# Altium schematic sheet 十六继电器.SchDoc: 阿波罗十六继电器控制器
size A4; Revision: V1.1; SheetNumber: 0; SheetTotal: 0
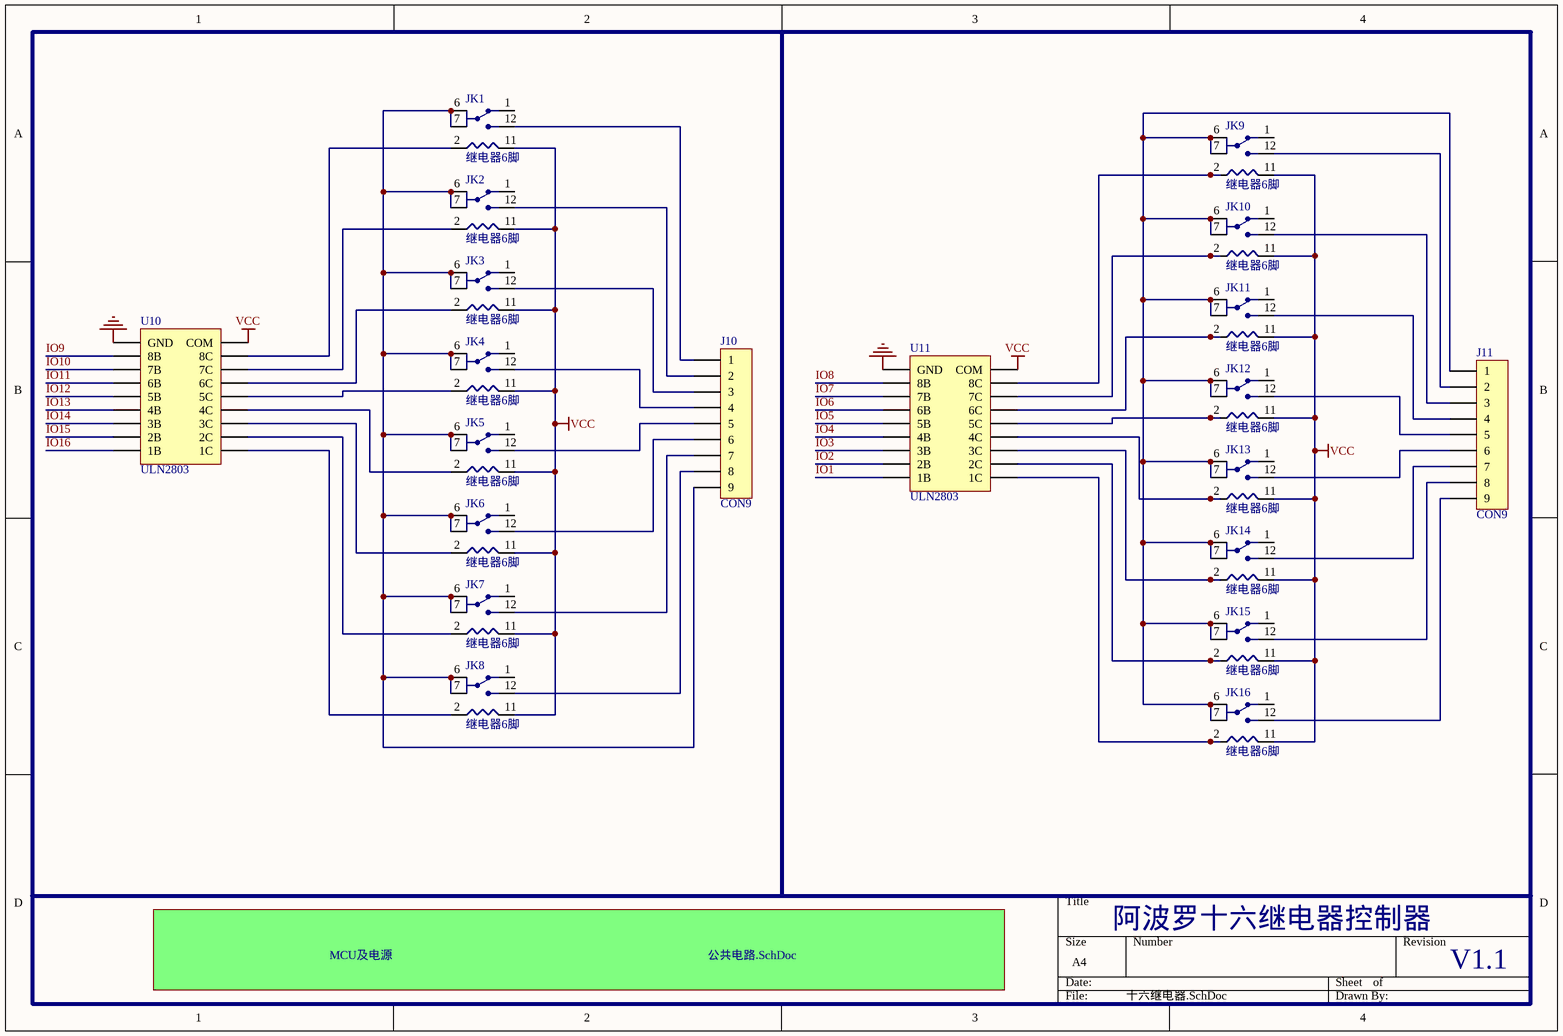
[diagram p0: 十六继电器.SchDoc]

## Parts
J10  CON9  [CON9*5.1]
J11  CON9  [CON9*5.1]
JK1  继电器6脚  [RL]
JK2  继电器6脚  [RL]
JK3  继电器6脚  [RL]
JK4  继电器6脚  [RL]
JK5  继电器6脚  [RL]
JK6  继电器6脚  [RL]
JK7  继电器6脚  [RL]
JK8  继电器6脚  [RL]
JK9  继电器6脚  [RL]
JK10  继电器6脚  [RL]
JK11  继电器6脚  [RL]
JK12  继电器6脚  [RL]
JK13  继电器6脚  [RL]
JK14  继电器6脚  [RL]
JK15  继电器6脚  [RL]
JK16  继电器6脚  [RL]
U10  ULN2803  [sol18]
U11  ULN2803  [sol18]

## Sub-sheets
MCU及电源 = 公共电路.SchDoc: no entries

## Nets
GND: U10.9(GND) U11.9(GND)
VCC: JK1.11 JK2.11 JK3.11 JK4.11 JK5.11 JK6.11 JK7.11 JK8.11 JK9.11 JK10.11 JK11.11 JK12.11 JK13.11 JK14.11 JK15.11 JK16.11 U10.10(COM) U11.10(COM)
IO1: U11.1(1B)
IO2: U11.2(2B)
IO3: U11.3(3B)
IO4: U11.4(4B)
IO5: U11.5(5B)
IO6: U11.6(6B)
IO7: U11.7(7B)
IO8: U11.8(8B)
IO9: U10.8(8B)
IO10: U10.7(7B)
IO11: U10.6(6B)
IO12: U10.5(5B)
IO13: U10.4(4B)
IO14: U10.3(3B)
IO15: U10.2(2B)
IO16: U10.1(1B)
NetJ10_1: J10.1 JK1.12
NetJ10_2: J10.2 JK2.12
NetJ10_3: J10.3 JK3.12
NetJ10_4: J10.4 JK4.12
NetJ10_5: J10.5 JK5.12
NetJ10_6: J10.6 JK6.12
NetJ10_7: J10.7 JK7.12
NetJ10_8: J10.8 JK8.12
NetJ10_9: J10.9 JK1.6 JK1.7 JK2.6 JK2.7 JK3.6 JK3.7 JK4.6 JK4.7 JK5.6 JK5.7 JK6.6 JK6.7 JK7.6 JK7.7 JK8.6 JK8.7
NetJ11_1: J11.1 JK9.6 JK9.7 JK10.6 JK10.7 JK11.6 JK11.7 JK12.6 JK12.7 JK13.6 JK13.7 JK14.6 JK14.7 JK15.6 JK15.7 JK16.6 JK16.7
NetJ11_2: J11.2 JK9.12
NetJ11_3: J11.3 JK10.12
NetJ11_4: J11.4 JK11.12
NetJ11_5: J11.5 JK12.12
NetJ11_6: J11.6 JK13.12
NetJ11_7: J11.7 JK14.12
NetJ11_8: J11.8 JK15.12
NetJ11_9: J11.9 JK16.12
NetJK1_2: JK1.2 U10.11(8C)
NetJK2_2: JK2.2 U10.12(7C)
NetJK3_2: JK3.2 U10.13(6C)
NetJK4_2: JK4.2 U10.14(5C)
NetJK5_2: JK5.2 U10.15(4C)
NetJK6_2: JK6.2 U10.16(3C)
NetJK7_2: JK7.2 U10.17(2C)
NetJK8_2: JK8.2 U10.18(1C)
NetJK9_2: JK9.2 U11.11(8C)
NetJK10_2: JK10.2 U11.12(7C)
NetJK11_2: JK11.2 U11.13(6C)
NetJK12_2: JK12.2 U11.14(5C)
NetJK13_2: JK13.2 U11.15(4C)
NetJK14_2: JK14.2 U11.16(3C)
NetJK15_2: JK15.2 U11.17(2C)
NetJK16_2: JK16.2 U11.18(1C)

Not connected (* = marked no-connect by the designer): JK1 1; JK2 1; JK3 1; JK4 1; JK5 1; JK6 1; JK7 1; JK8 1; JK9 1; JK10 1; JK11 1; JK12 1; JK13 1; JK14 1; JK15 1; JK16 1